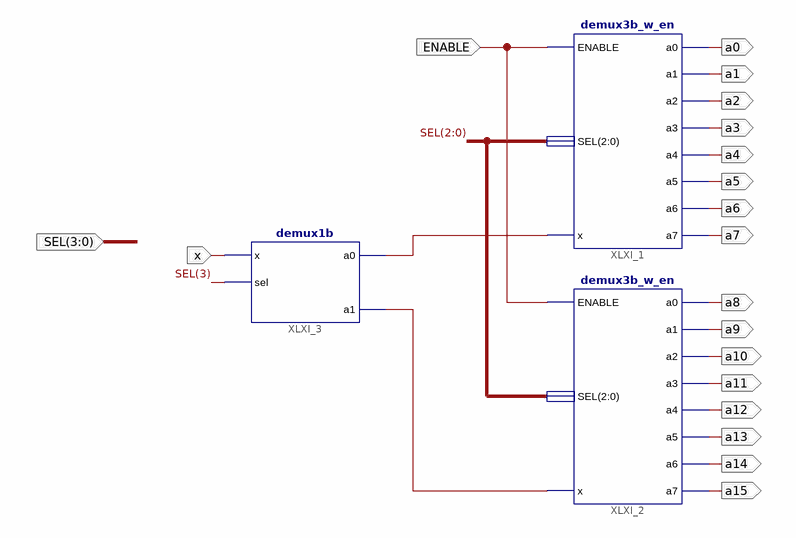
[diagram p0: schematic sheet 1]
// Xilinx ISE schematic demux4b_w_en.sch (artix7) as structural Verilog: 3 symbols, 19 ports
module demux4b_w_en (
  input  ENABLE,
  input  x,
  input  [3:0] SEL,
  output a0,
  output a1,
  output a2,
  output a3,
  output a4,
  output a5,
  output a6,
  output a7,
  output a8,
  output a9,
  output a10,
  output a11,
  output a12,
  output a13,
  output a14,
  output a15
);

  wire XLXN_1, XLXN_2;

  demux3b_w_en XLXI_1 (
    .ENABLE(ENABLE), .SEL(SEL[2:0]), .x(XLXN_1), .a0(a0), .a1(a1), .a2(a2), .a3(a3), .a4(a4), .a5(a5),
    .a6(a6), .a7(a7));
  demux3b_w_en XLXI_2 (
    .ENABLE(ENABLE), .SEL(SEL[2:0]), .x(XLXN_2), .a0(a8), .a1(a9), .a2(a10), .a3(a11), .a4(a12), .a5(a13),
    .a6(a14), .a7(a15));
  demux1b XLXI_3 (.x(x), .sel(SEL[3]), .a0(XLXN_1), .a1(XLXN_2));
endmodule
